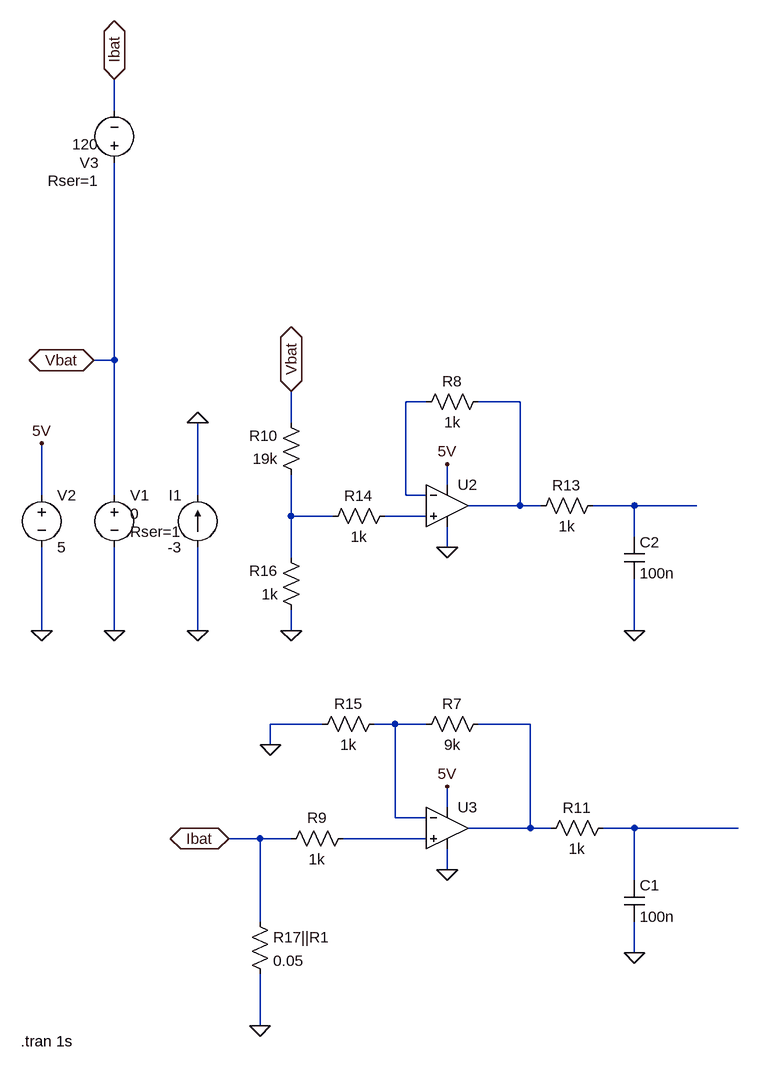
[diagram p0: schematic CourseExample.asc]
CourseExample.asc, the LTspice schematic file:
Version 4.1
SHEET 1 880 1032
WIRE -304 -416 -304 -464
WIRE -304 -32 -304 -336
WIRE -304 -32 -336 -32
WIRE 176 32 144 32
WIRE 320 32 256 32
WIRE -32 64 -32 16
WIRE 208 160 208 128
WIRE -416 176 -416 96
WIRE -304 176 -304 -32
WIRE -176 176 -176 64
WIRE 144 176 144 32
WIRE 176 176 144 176
WIRE 320 192 320 32
WIRE 320 192 240 192
WIRE 352 192 320 192
WIRE 496 192 432 192
WIRE 592 192 496 192
WIRE -32 208 -32 144
WIRE 32 208 -32 208
WIRE 176 208 112 208
WIRE 496 240 496 192
WIRE 208 256 208 224
WIRE -32 272 -32 208
WIRE -416 384 -416 256
WIRE -304 384 -304 256
WIRE -176 384 -176 256
WIRE -32 384 -32 352
WIRE 496 384 496 304
WIRE 16 528 -64 528
WIRE 128 528 96 528
WIRE 176 528 128 528
WIRE 336 528 256 528
WIRE -64 560 -64 528
WIRE 208 656 208 624
WIRE 128 672 128 528
WIRE 176 672 128 672
WIRE 336 688 336 528
WIRE 336 688 240 688
WIRE 368 688 336 688
WIRE 496 688 448 688
WIRE 656 688 496 688
WIRE -80 704 -128 704
WIRE -32 704 -80 704
WIRE 176 704 48 704
WIRE 208 752 208 720
WIRE 496 768 496 688
WIRE -80 832 -80 704
WIRE 496 880 496 832
WIRE -80 992 -80 912
FLAG 208 256 0
FLAG -32 384 0
FLAG 496 384 0
FLAG -336 -32 Vbat
IOPIN -336 -32 BiDir
FLAG -416 96 5V
FLAG -416 384 0
FLAG -304 384 0
FLAG 208 128 5V
FLAG -32 16 Vbat
IOPIN -32 16 BiDir
FLAG -176 384 0
FLAG 496 880 0
FLAG 208 752 0
FLAG -64 560 0
FLAG 208 624 5V
FLAG -304 -464 Ibat
IOPIN -304 -464 BiDir
FLAG -128 704 Ibat
IOPIN -128 704 BiDir
FLAG -80 992 0
FLAG -176 64 0
SYMBOL res 128 192 R90
WINDOW 0 0 56 VBottom 2
WINDOW 3 32 56 VTop 2
SYMATTR InstName R14
SYMATTR Value 1k
SYMBOL res -16 160 R180
WINDOW 0 36 76 Left 2
WINDOW 3 36 40 Left 2
SYMATTR InstName R10
SYMATTR Value 19k
SYMBOL res -16 368 R180
WINDOW 0 36 76 Left 2
WINDOW 3 36 40 Left 2
SYMATTR InstName R16
SYMATTR Value 1k
SYMBOL res 160 48 R270
WINDOW 0 32 56 VTop 2
WINDOW 3 0 56 VBottom 2
SYMATTR InstName R8
SYMATTR Value 1k
SYMBOL res 336 208 R270
WINDOW 0 32 56 VTop 2
WINDOW 3 0 56 VBottom 2
SYMATTR InstName R13
SYMATTR Value 1k
SYMBOL cap 480 240 R0
SYMATTR InstName C2
SYMATTR Value 100n
SYMBOL voltage -304 160 R0
WINDOW 3 24 44 Left 2
WINDOW 123 0 0 Left 0
WINDOW 39 24 72 Left 2
SYMATTR InstName V1
SYMATTR Value 0
SYMATTR SpiceLine Rser=1
SYMBOL voltage -416 160 R0
WINDOW 123 0 0 Left 0
WINDOW 39 0 0 Left 0
SYMATTR InstName V2
SYMATTR Value 5
SYMBOL current -176 256 R180
WINDOW 0 24 80 Left 2
WINDOW 3 24 0 Left 2
WINDOW 123 0 0 Left 0
WINDOW 39 0 0 Left 0
SYMATTR InstName I1
SYMATTR Value -3
SYMBOL OpAmps\\UniversalOpAmp 208 192 R0
SYMATTR InstName U2
SYMBOL OpAmps\\UniversalOpAmp 208 688 R0
SYMATTR InstName U3
SYMBOL res 64 688 R90
WINDOW 0 0 56 VBottom 2
WINDOW 3 32 56 VTop 2
SYMATTR InstName R9
SYMATTR Value 1k
SYMBOL res 272 512 R90
WINDOW 0 0 56 VBottom 2
WINDOW 3 32 56 VTop 2
SYMATTR InstName R7
SYMATTR Value 9k
SYMBOL res 112 512 R90
WINDOW 0 0 56 VBottom 2
WINDOW 3 32 56 VTop 2
SYMATTR InstName R15
SYMATTR Value 1k
SYMBOL res 464 672 R90
WINDOW 0 0 56 VBottom 2
WINDOW 3 32 56 VTop 2
SYMATTR InstName R11
SYMATTR Value 1k
SYMBOL cap 480 768 R0
SYMATTR InstName C1
SYMATTR Value 100n
SYMBOL res -96 816 R0
SYMATTR InstName R17||R1
SYMATTR Value 0.05
SYMBOL voltage -304 -320 R180
WINDOW 3 24 44 Left 2
WINDOW 123 0 0 Left 0
WINDOW 39 24 -12 Left 2
SYMATTR InstName V3
SYMATTR Value 120
SYMATTR SpiceLine Rser=1
TEXT -448 1016 Left 2 !.tran 1s

The netlist it stands for:
* CourseExample.asc
R14 N005 N004 1k
R10 N004 Vbat 19k
R16 0 N004 1k
R8 N001 N002 1k
R13 N002 N003 1k
C2 N003 0 100n
V1 Vbat 0 0 Rser=1
V2 5V 0 5
I1 0 0 -3
X§U2 N005 N001 5V 0 N002 level1 Avol=1Meg GBW=10Meg Vos=0 En=0 Enk=0 In=0 Ink=0 Rin=500Meg  ; pins In+ In- V+ V- OUT
X§U3 N009 N006 5V 0 N007 level1 Avol=1Meg GBW=10Meg Vos=0 En=0 Enk=0 In=0 Ink=0 Rin=500Meg  ; pins In+ In- V+ V- OUT
R9 N009 Ibat 1k
R7 N007 N006 9k
R15 N006 0 1k
R11 N008 N007 1k
C1 N008 0 100n
R17||R1 Ibat 0 0.05
V3 Vbat Ibat 120 Rser=1
.tran 1s
.lib UniversalOpAmp1.lib
.backanno
.end